# Altium schematic sheet power.SchDoc
size A3
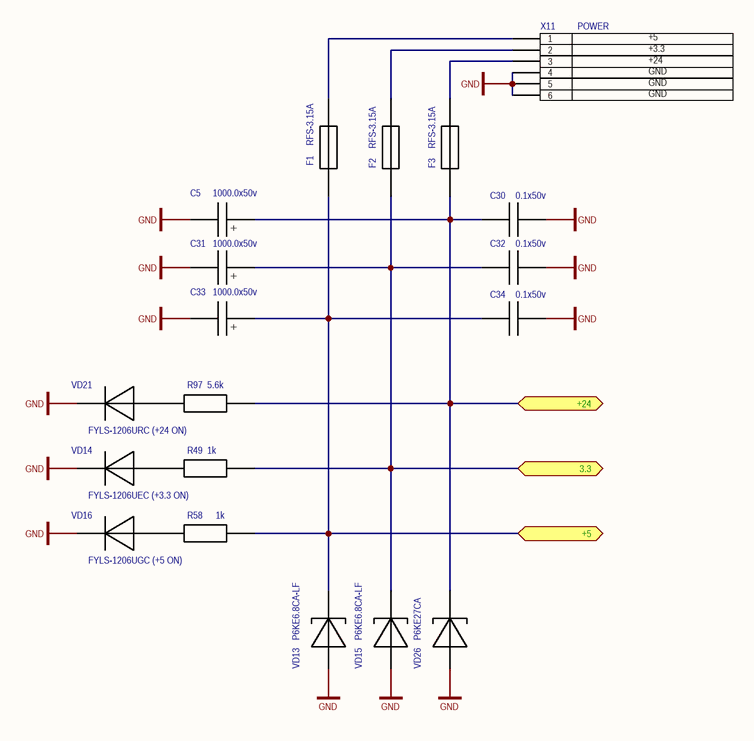
[diagram p0: power.SchDoc]

## Parts
C5  1000.0x50v  [C-LOW-ESR-16-18]
C30  0.1x50v  [CAPC3216X05N]
C31  1000.0x50v  [C-LOW-ESR-16-18]
C32  0.1x50v  [CAPC3216X05N]
C33  1000.0x50v  [C-LOW-ESR-16-18]
C34  0.1x50v  [CAPC3216X05N]
F1  RFS-3.15A  [MRT-FUSE]
F2  RFS-3.15A  [MRT-FUSE]
F3  RFS-3.15A  [MRT-FUSE]
R49  1k  [RESC2012X04N]
R58  1k  [RESC2012X04N]
R97  5.6k  [RESC2012X04N]
VD13  P6KE6.8CA-LF  [P6KE27CA]
VD14  FYLS-1206UEC (+3.3 ON)  [CAPMP3216X11N]
VD15  P6KE6.8CA-LF  [P6KE27CA]
VD16  FYLS-1206UGC (+5 ON)  [CAPMP3216X11N]
VD21  FYLS-1206URC (+24 ON)  [CAPMP3216X11N]
VD26  P6KE27CA  [P6KE27CA]
X11  POWER  [MINI-FIT-6WAY-SM]

## Ports
3.3, +5, +24

## Nets
GND: C5.2 C30.2 C31.2 C32.2 C33.2 C34.2 VD13.A VD14.1(C) VD15.A VD16.1(C) VD21.1(C) VD26.A X11.4 X11.5 X11.6
3.3: C31.1(+) C32.1 F2.1 R49.2 VD15.K ; port 3.3
+5: C33.1(+) C34.1 F1.1 R58.2 VD13.K ; port +5
+24: C5.1(+) C30.1 F3.1 R97.2 VD26.K ; port +24
NetF1_2: F1.2 X11.1
NetF2_2: F2.2 X11.2
NetF3_2: F3.2 X11.3
NetR49_1: R49.1 VD14.2(A)
NetR58_1: R58.1 VD16.2(A)
NetR97_1: R97.1 VD21.2(A)

## Notes on the sheet
- +5
- +3.3
- +24
- GND

## Library data of the parts
C5 C31 C33 = C-LOW-ESR-RADIAL: Выводной электролит
C30 C32 C34 = C: SMD конденсатор; Ref: http://www.kosmodrom.com.ua/prodlist.php?name=cap1206
F1-F3 = FUSE: Вставка плавкая; Ref: http://www.kosmodrom.com.ua/el.php?name=RFT-2.5A
R49 R58 R97 = R: SMD резистор; Ref: http://www.kosmodrom.com.ua/prodlist.php?name=res1206
VD13 VD15 VD26 = P6KE27CA: Cупрессор; Ref: https://prom.ua/p207053054-p6ke27ca;all.html
VD14 VD16 VD21 = FYLS-1206: Светодиод; Ref: http://www.kosmodrom.com.ua/prodlist.php?page=0&name=FYLS-1206&okbutton=%CF%EE%E8%F1%EA+%EF%EE+%F1%EA%EB%E0%E4%F3
X11 = MINI-FIT-6-WAY-M